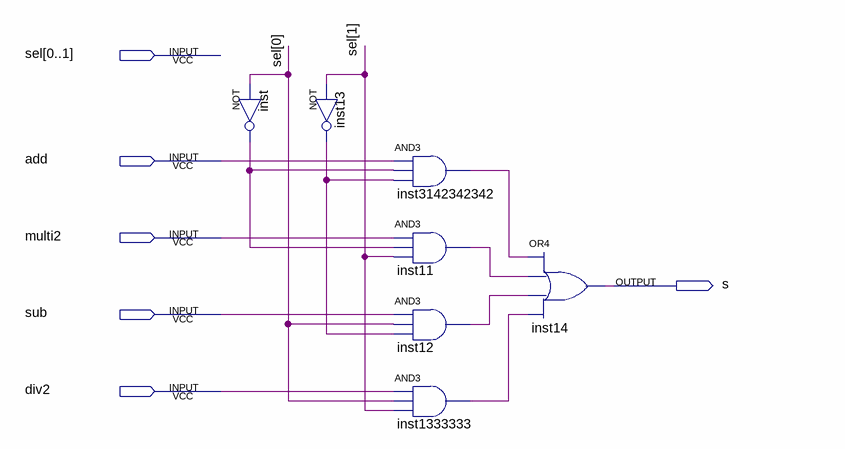
[diagram p0: schematic sheet]
// Quartus schematic mux.bdf as structural Verilog: 7 symbols, 6 pins
module mux (
  input  [0:1] sel,
  input  add,
  input  multi2,
  input  sub,
  input  div2,
  output s
);

  wire inst11_out, inst12_out, inst13_out, inst1333333_out, inst3142342342_out, inst_out;

  not inst (inst_out, sel[0]);
  not inst13 (inst13_out, sel[1]);
  and inst3142342342 (inst3142342342_out, add, inst_out, inst13_out);
  and inst11 (inst11_out, multi2, inst_out, sel[1]);
  and inst12 (inst12_out, sub, sel[0], inst13_out);
  and inst1333333 (inst1333333_out, div2, sel[0], sel[1]);
  or inst14 (s, inst3142342342_out, inst11_out, inst12_out, inst1333333_out);
endmodule
